# EAGLE design PCB - MODULE (EAGLE 8.2.0)

## Sheet 1 of 4: STN1170
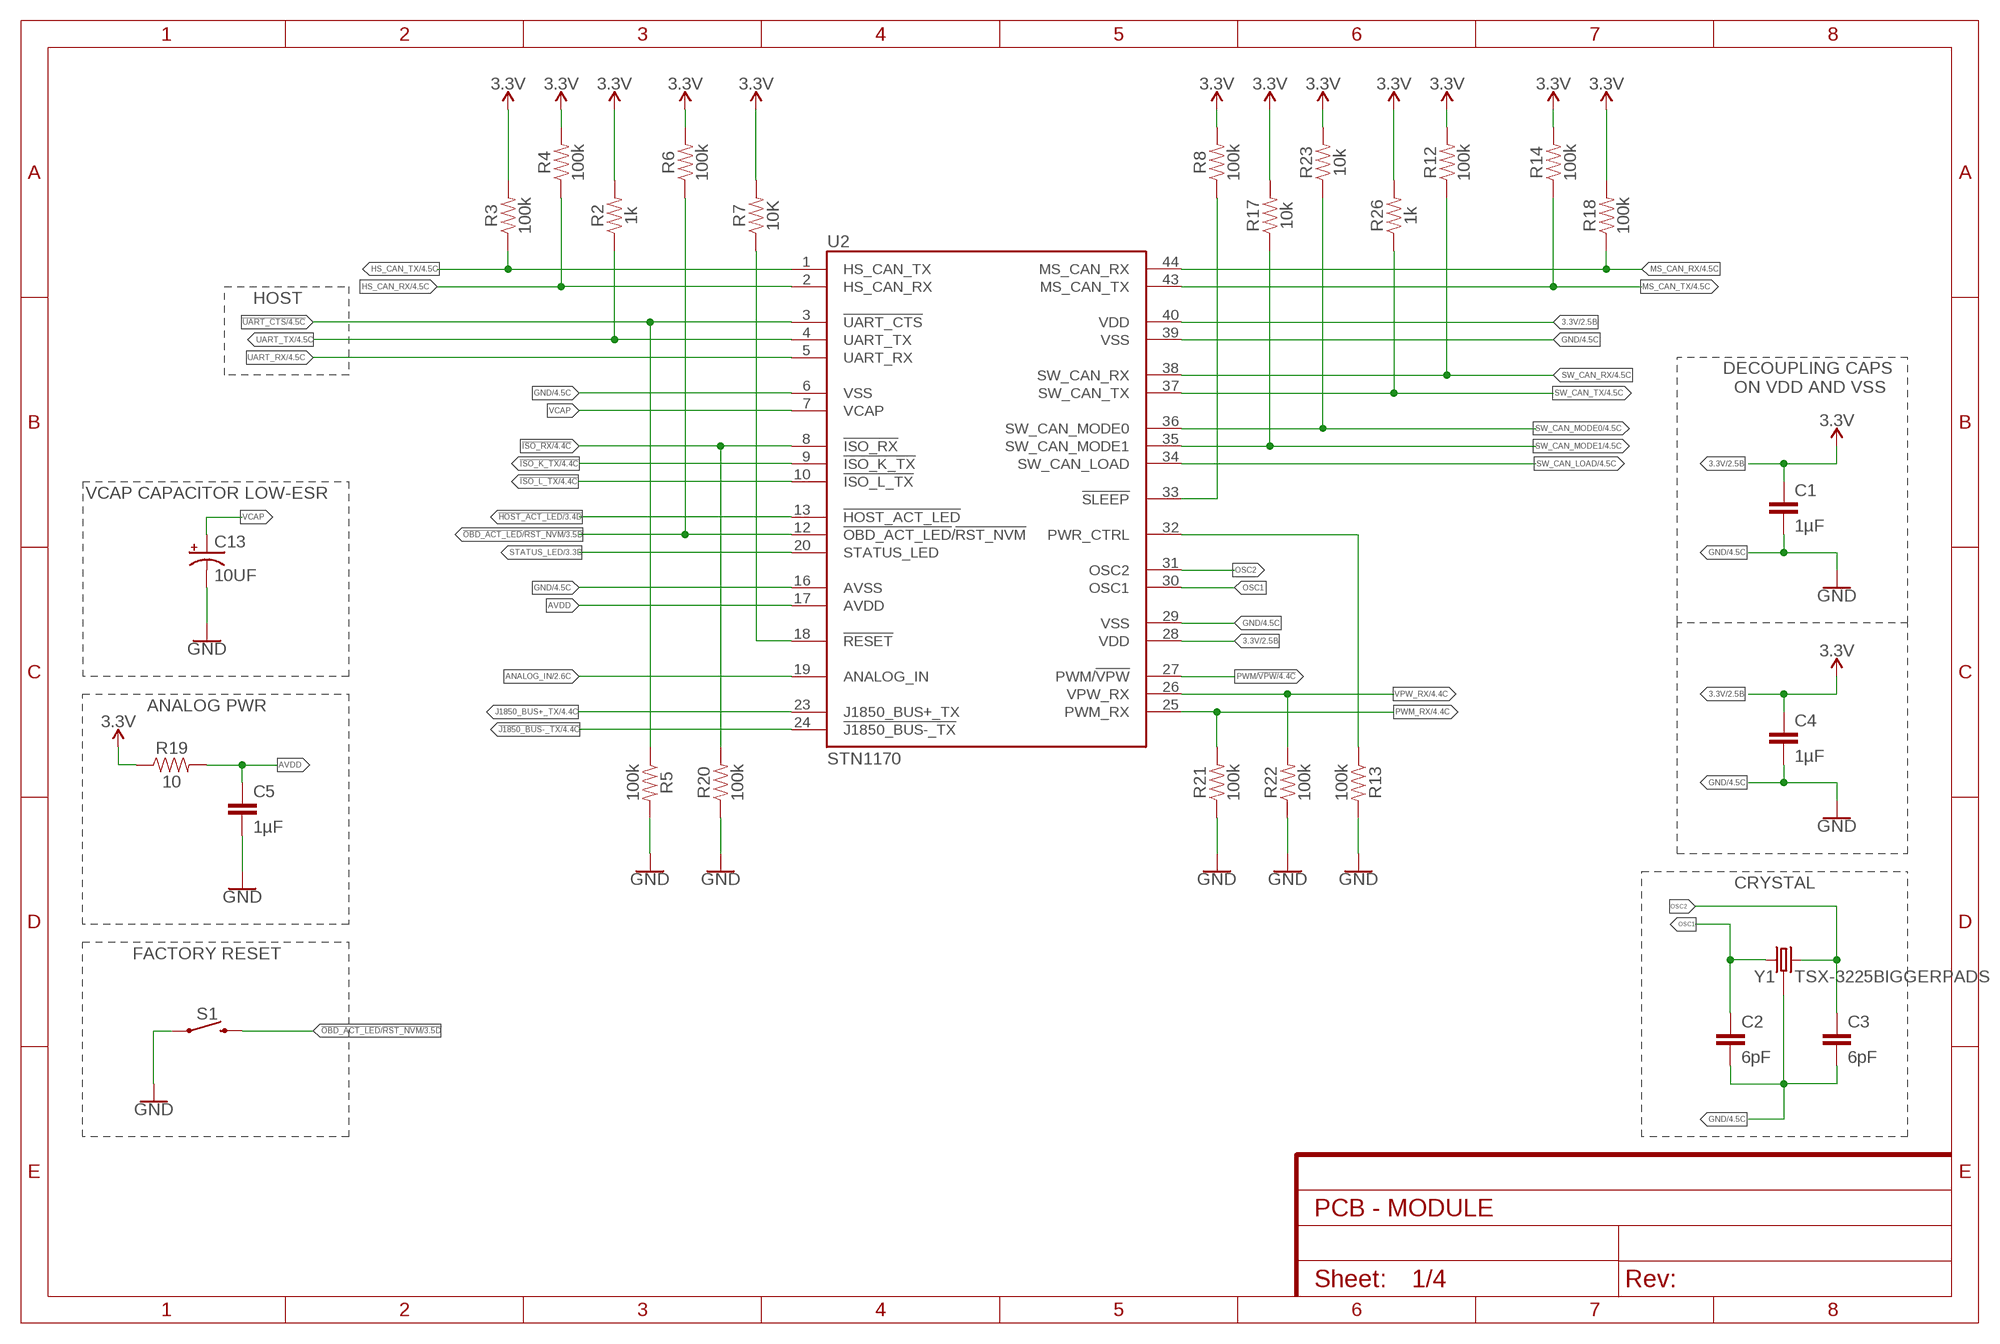
[diagram p0: schematic, sheet 1]

### Parts
C1  1µF  0.33UF/330NF-0805-50V-10%  [0805]
C2  6pF  0.33UF/330NF-0805-50V-10%  [0805]
C3  6pF  0.33UF/330NF-0805-50V-10%  [0805]
C4  1µF  0.33UF/330NF-0805-50V-10%  [0805]
C5  1µF  0.33UF/330NF-0805-50V-10%  [0805]
C13  10UF  [1206]
R2  1k  0.75OHM-0805-1/4W-1%  [0805]
R3  100k  0.75OHM-0805-1/4W-1%  [0805]
R4  100k  0.75OHM-0805-1/4W-1%  [0805]
R5  100k  0.75OHM-0805-1/4W-1%  [0805]
R6  100k  0.75OHM-0805-1/4W-1%  [0805]
R7  10K  0.75OHM-0805-1/4W-1%  [0805]
R8  100k  0.75OHM-0805-1/4W-1%  [0805]
R12  100k  0.75OHM-0805-1/4W-1%  [0805]
R13  100k  0.75OHM-0805-1/4W-1%  [0805]
R14  100k  0.75OHM-0805-1/4W-1%  [0805]
R17  10k  0.75OHM-0805-1/4W-1%  [0805]
R18  100k  0.75OHM-0805-1/4W-1%  [0805]
R19  10  0.75OHM-0805-1/4W-1%  [0805]
R20  100k  0.75OHM-0805-1/4W-1%  [0805]
R21  100k  0.75OHM-0805-1/4W-1%  [0805]
R22  100k  0.75OHM-0805-1/4W-1%  [0805]
R23  10k  0.75OHM-0805-1/4W-1%  [0805]
R26  1k  0.75OHM-0805-1/4W-1%  [0805]
S1  B3U  [B3U-WO-GT-WO-B]
U2  STN1170  [TQFP44]
Y1  TSX-3225BIGGERPADS  [TSX-3225-SOLDERING-IRON]

### Nets
3.3V: C1.1 C4.1 R2.2 R3.2 R4.2 R6.2 R7.2 R8.2 R12.2 R14.2 R17.2 R18.2 R19.1 R23.2 R26.2 U2.28(VDD) U2.40(VDD) ; also sheet 2,3,4
!HOST_ACT_LED: U2.13(!HOST_ACT_LED) ; also sheet 3
!ISO_K_TX: U2.9(!ISO_K_TX) ; also sheet 4
!ISO_L_TX: U2.10(!ISO_L_TX) ; also sheet 4
!ISO_RX: R20.2 U2.8(!ISO_RX) ; also sheet 4
!J1850_BUS-_TX: U2.24(!J1850_BUS-_TX) ; also sheet 4
!OBD_ACT_LED!/!RST_NVM: R6.1 S1.2 U2.12(!OBD_ACT_LED!/!RST_NVM) ; also sheet 3
!RESET: R7.1 U2.18(!RESET)
!SLEEP: R8.1 U2.33(!SLEEP)
!UART_CTS: R5.1 U2.3(!UART_CTS) ; also sheet 4
ANALOG_IN: U2.19(ANALOG_IN) ; also sheet 2
AVDD: C5.1 R19.2 U2.17(AVDD)
GND: C1.2 C2.2 C3.2 C4.2 C5.2 C13.2(-) R5.2 R13.2 R20.1 R21.1 R22.1 S1.1 U2.6(VSS) U2.16(AVSS) U2.29(VSS) U2.39(VSS) Y1.2 Y1.4 ; also sheet 2,3,4
HS_CAN_RX: R4.1 U2.2(HS_CAN_RX) ; also sheet 4
HS_CAN_TX: R3.1 U2.1(HS_CAN_TX) ; also sheet 4
J1850_BUS+_TX: U2.23(J1850_BUS+_TX) ; also sheet 4
MS_CAN_RX: R18.1 U2.44(MS_CAN_RX) ; also sheet 4
MS_CAN_TX: R14.1 U2.43(MS_CAN_TX) ; also sheet 4
OSC1: C2.1 U2.30(OSC1) Y1.1
OSC2: C3.1 U2.31(OSC2) Y1.3
PWM/!VPW: U2.27(PWM/!VPW!) ; also sheet 4
PWM_RX: R21.2 U2.25(PWM_RX) ; also sheet 4
PWR_CTRL: R13.1 U2.32(PWR_CTRL)
STATUS_LED: U2.20(STATUS_LED) ; also sheet 3
SW_CAN_LOAD: U2.34(SW_CAN_LOAD) ; also sheet 4
SW_CAN_MODE0: R23.1 U2.36(SW_CAN_MODE0) ; also sheet 4
SW_CAN_MODE1: R17.1 U2.35(SW_CAN_MODE1) ; also sheet 4
SW_CAN_RX: R12.1 U2.38(SW_CAN_RX) ; also sheet 4
SW_CAN_TX: R26.1 U2.37(SW_CAN_TX) ; also sheet 4
UART_RX: U2.5(UART_RX) ; also sheet 4
UART_TX: R2.1 U2.4(UART_TX) ; also sheet 4
VCAP: C13.1(+) U2.7(VCAP)
VPW_RX: R22.2 U2.26(VPW_RX) ; also sheet 4

### Notes on the sheet
- HOST
- DECOUPLING CAPS 
  ON VDD AND VSS
- VCAP CAPACITOR LOW-ESR
- ANALOG PWR
- CRYSTAL
- FACTORY RESET

## Sheet 2 of 4: Current Sense
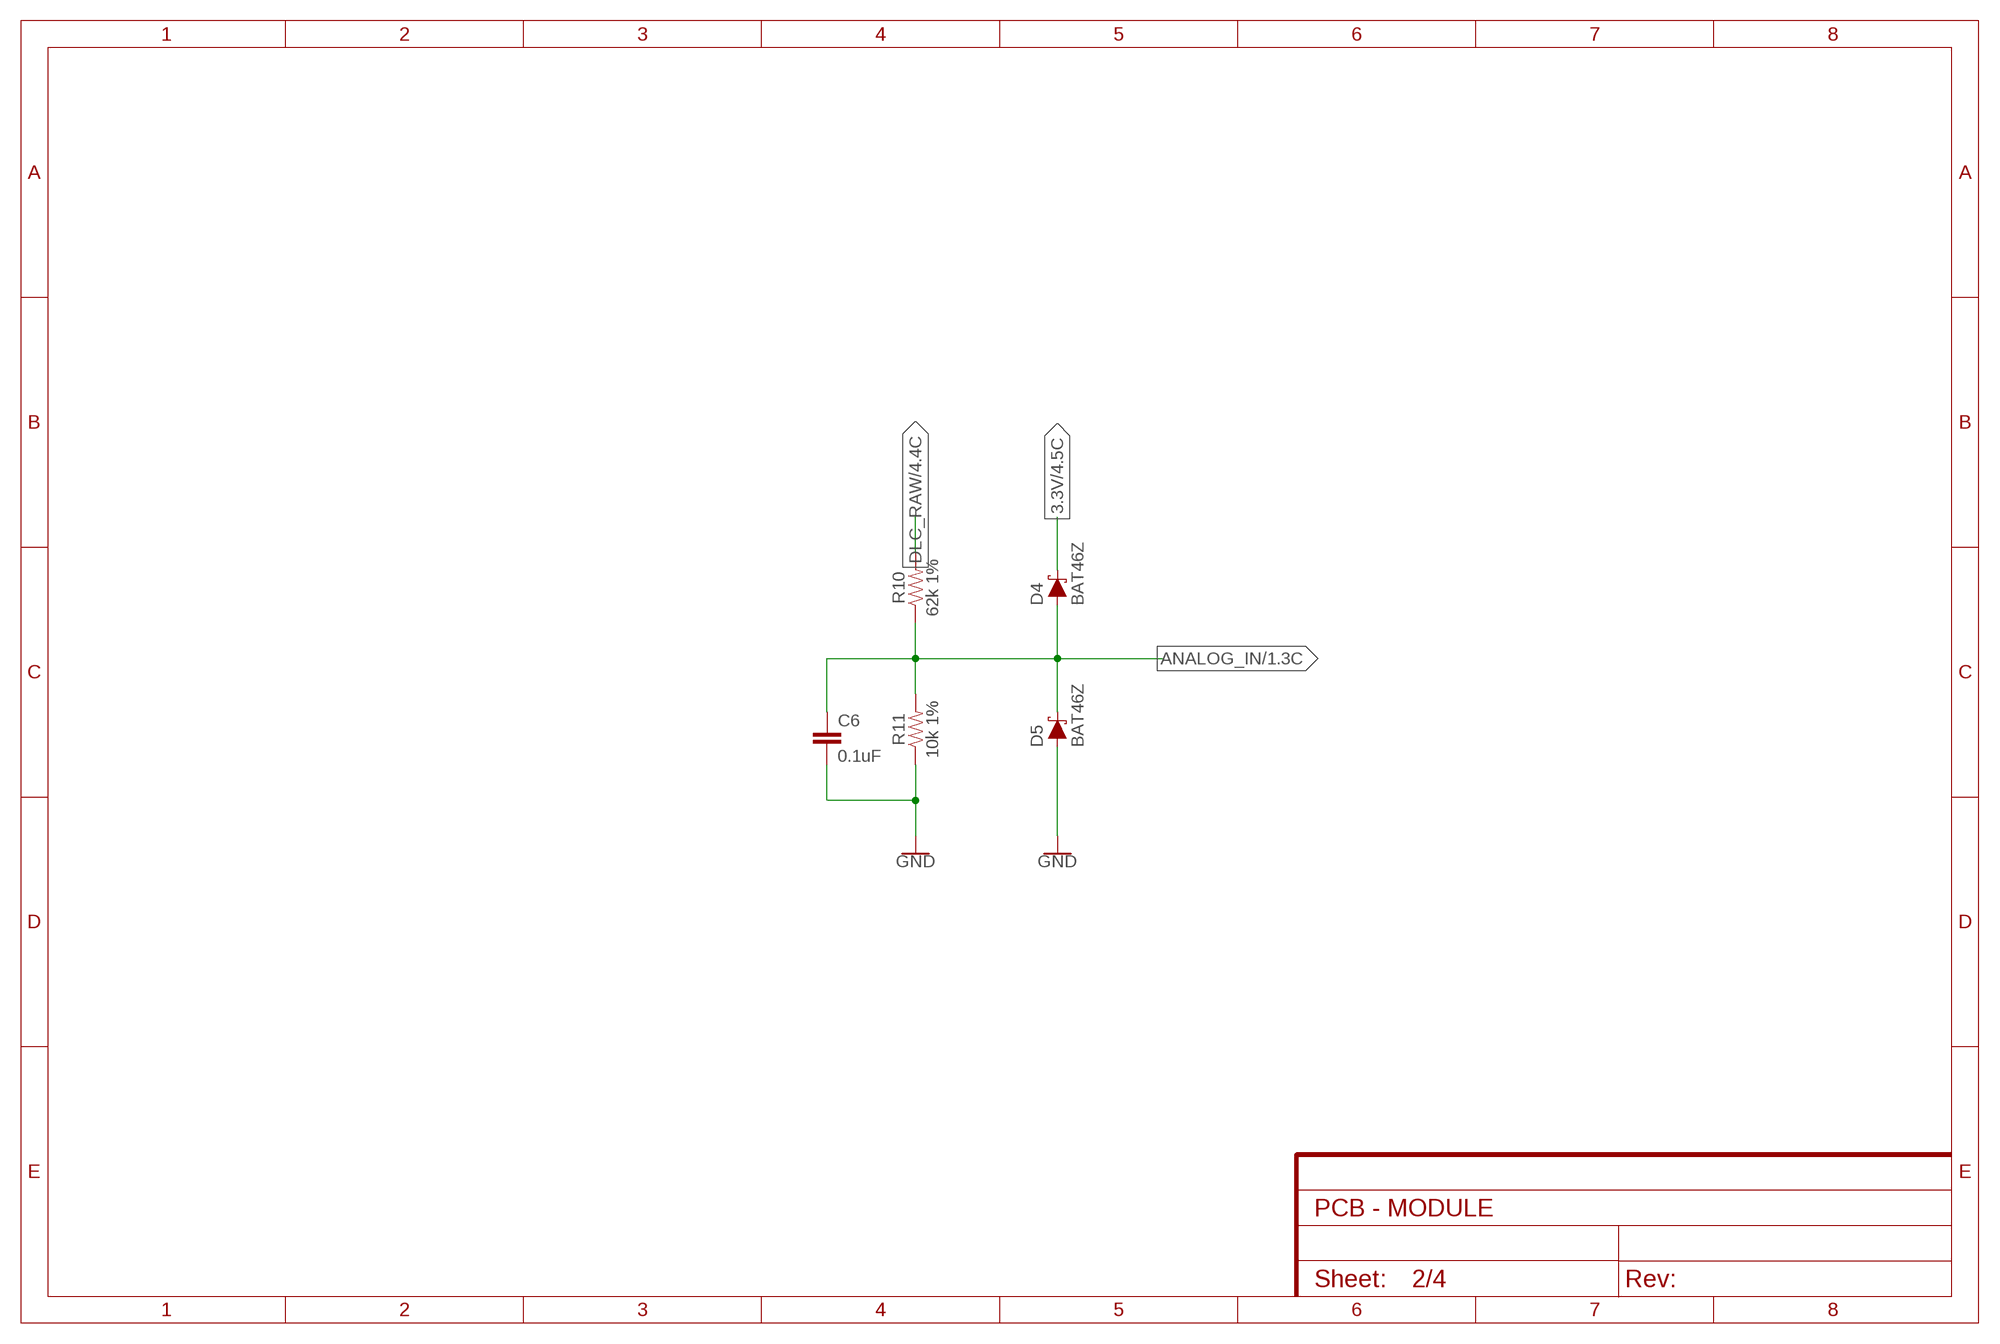
[diagram p1: schematic, sheet 2]

### Parts
C6  0.1uF  0.33UF/330NF-0805-50V-10%  [0805]
D4  BAT46Z  [SOD-123]
D5  BAT46Z  [SOD-123]
R10  62k 1%  0.75OHM-0805-1/4W-1%  [0805]
R11  10k 1%  0.75OHM-0805-1/4W-1%  [0805]

### Nets
3.3V: D4.C ; also sheet 1,3,4
ANALOG_IN: C6.1 D4.A D5.C R10.1 R11.2 ; also sheet 1
DLC_RAW: R10.2 ; also sheet 4
GND: C6.2 D5.A R11.1 ; also sheet 1,3,4

## Sheet 3 of 4: LED's
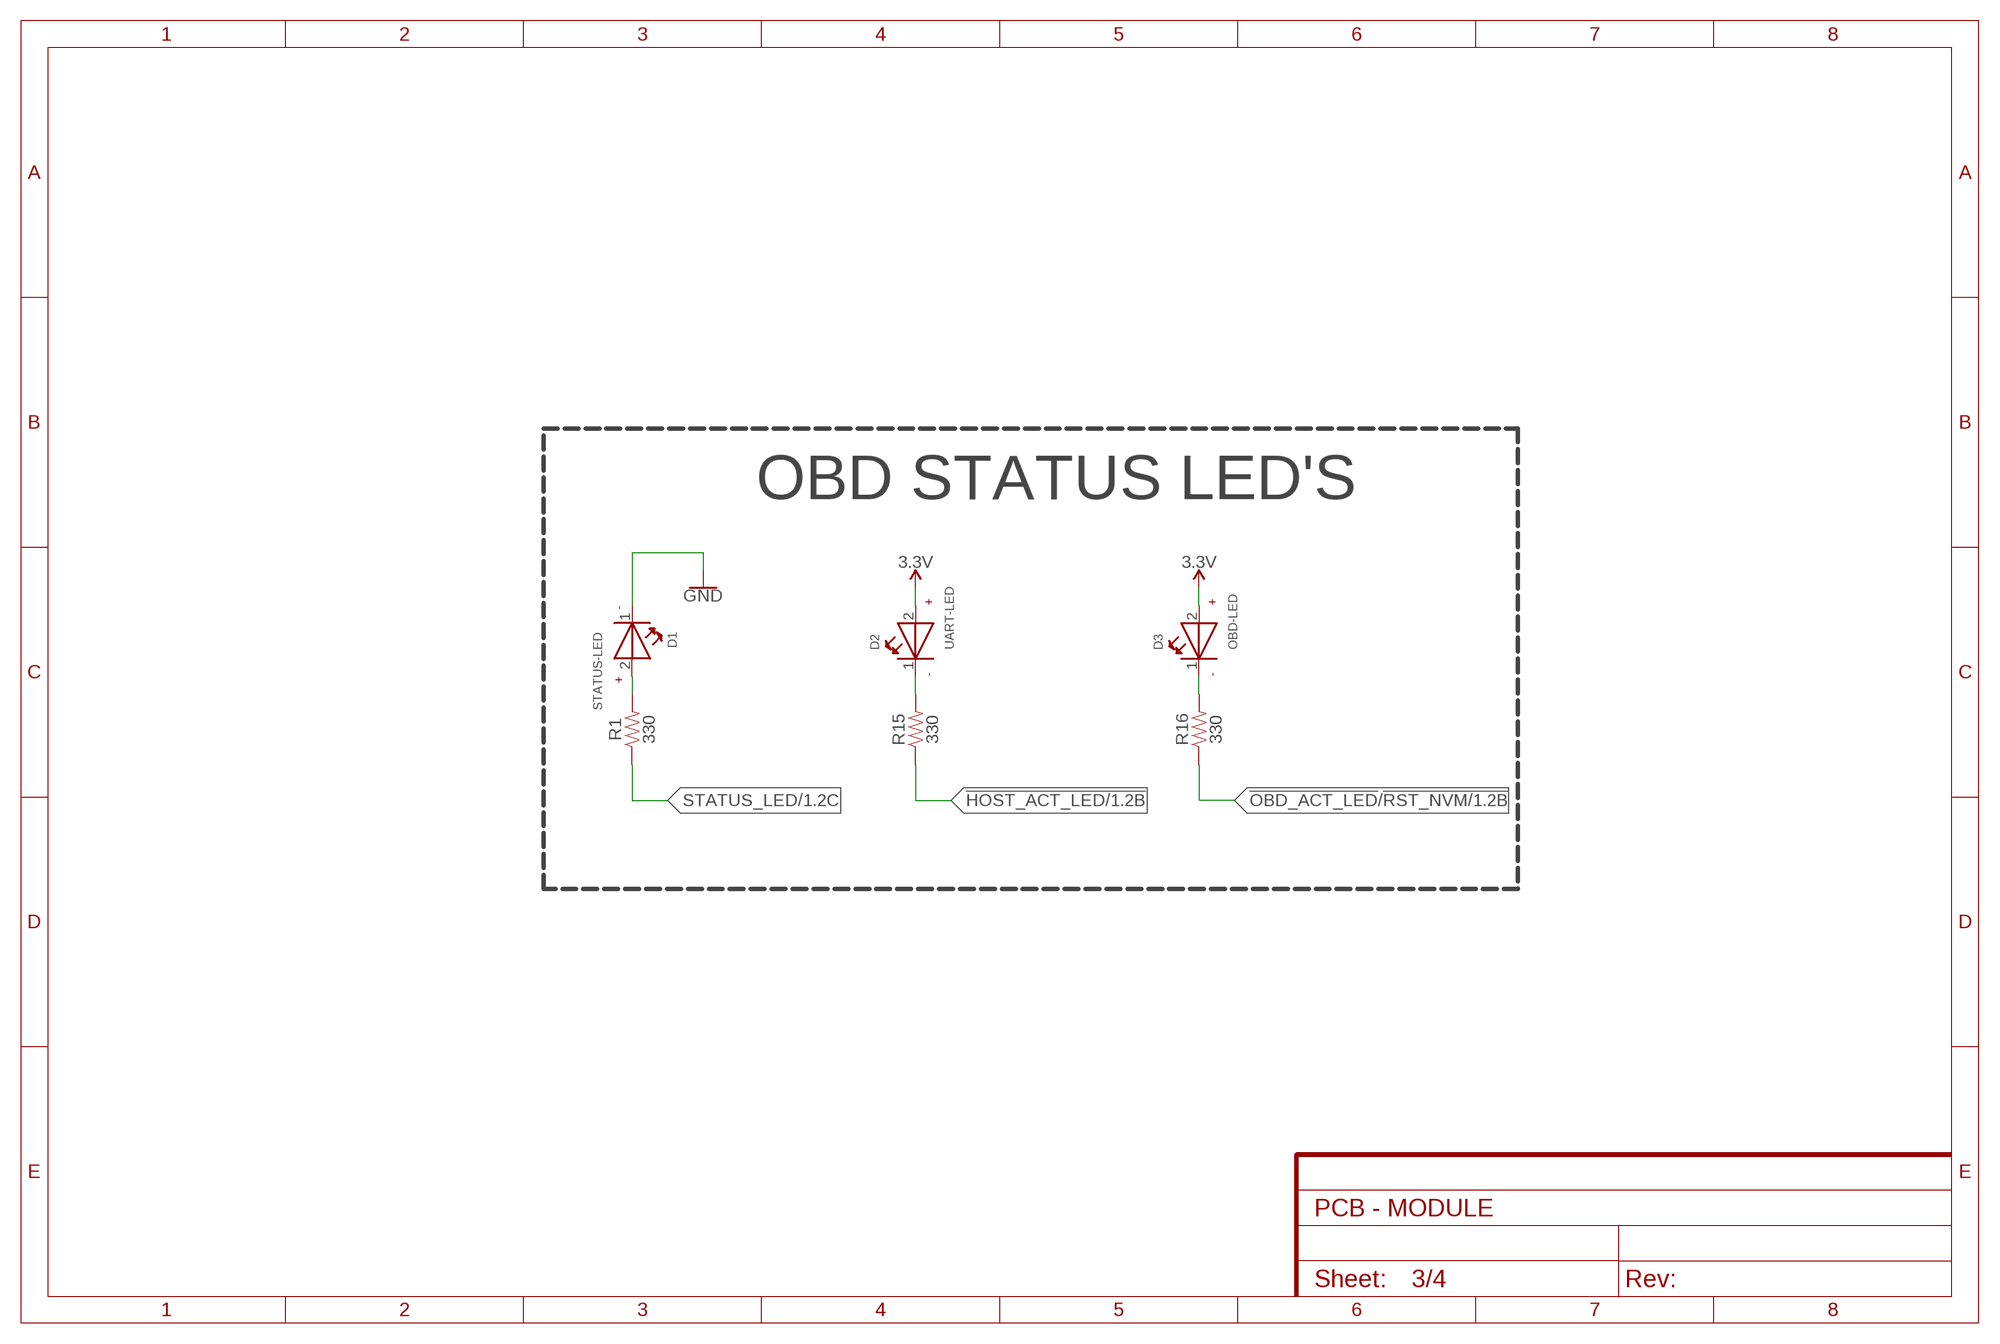
[diagram p2: schematic, sheet 3]

### Parts
D1  STATUS-LED  WL-SMCW-150120RS75000-R  [WL-SMCW_1206]
D2  UART-LED  WL-SMCW-150120YS75000-Y  [WL-SMCW_1206]
D3  OBD-LED  WL-SMCW-150120GS75000-G  [WL-SMCW_1206]
R1  330  0.75OHM-0805-1/4W-1%  [0805]
R15  330  0.75OHM-0805-1/4W-1%  [0805]
R16  330  0.75OHM-0805-1/4W-1%  [0805]

### Nets
3.3V: D2.2(+) D3.2(+) ; also sheet 1,2,4
!HOST_ACT_LED: R15.1 ; also sheet 1
!OBD_ACT_LED!/!RST_NVM: R16.1 ; also sheet 1
GND: D1.1(-) ; also sheet 1,2,4
N$3: D1.2(+) R1.2
N$4: D3.1(-) R16.2
N$5: D2.1(-) R15.2
STATUS_LED: R1.1 ; also sheet 1

### Notes on the sheet
- OBD STATUS LED'S

## Sheet 4 of 4: Pinout for board
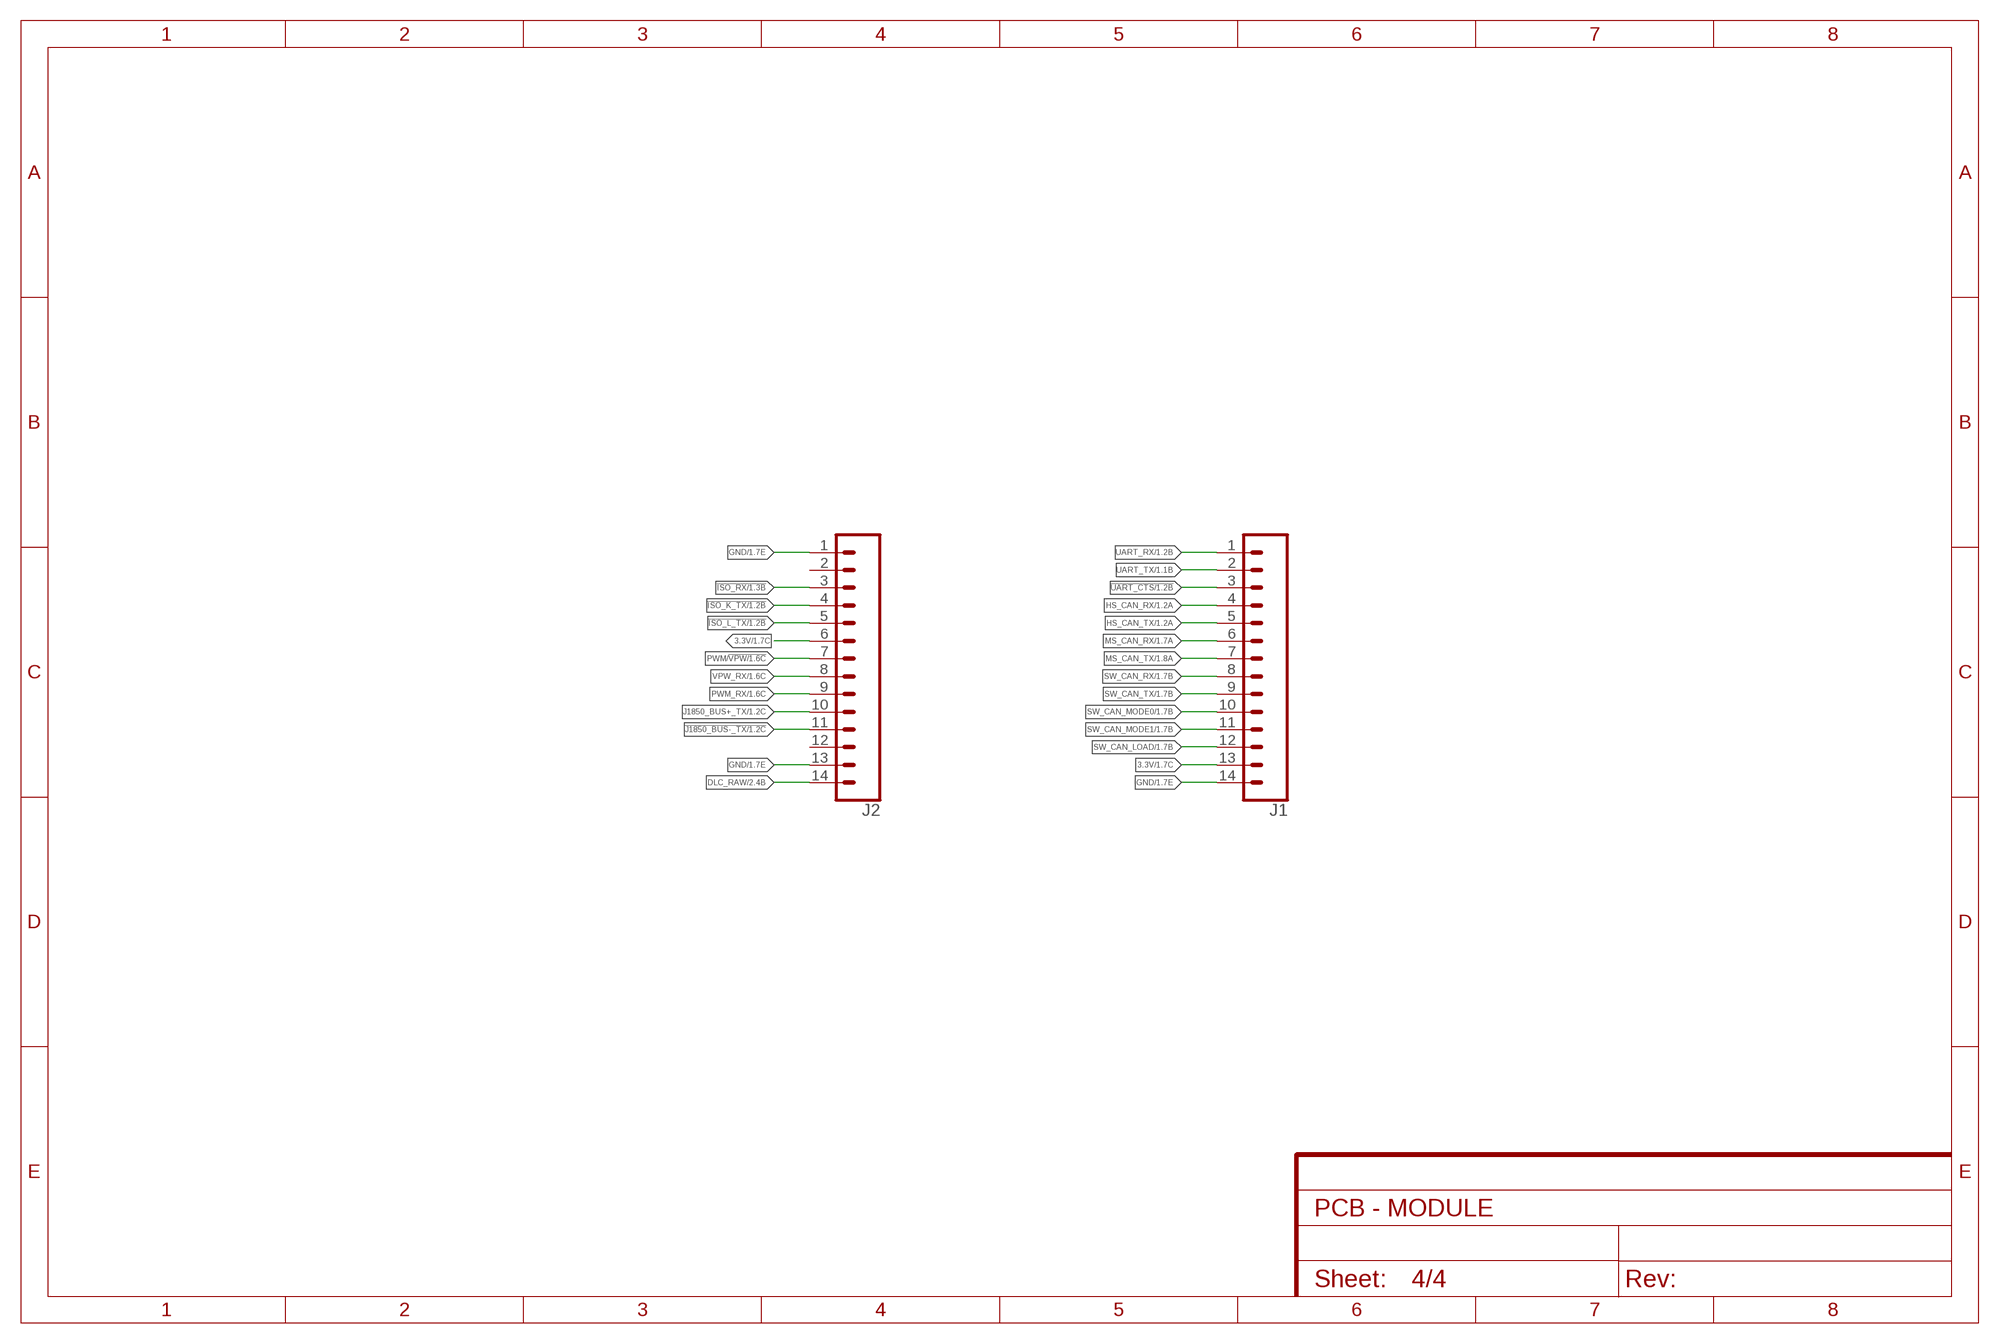
[diagram p3: schematic, sheet 4]

### Parts
J1  CONN_14  [1X14]
J2  CONN_14  [1X14]

### Nets
3.3V: J1.13 J2.6 ; also sheet 1,2,3
!ISO_K_TX: J2.4 ; also sheet 1
!ISO_L_TX: J2.5 ; also sheet 1
!ISO_RX: J2.3 ; also sheet 1
!J1850_BUS-_TX: J2.11 ; also sheet 1
!UART_CTS: J1.3 ; also sheet 1
DLC_RAW: J2.14 ; also sheet 2
GND: J1.14 J2.1 J2.13 ; also sheet 1,2,3
HS_CAN_RX: J1.4 ; also sheet 1
HS_CAN_TX: J1.5 ; also sheet 1
J1850_BUS+_TX: J2.10 ; also sheet 1
MS_CAN_RX: J1.6 ; also sheet 1
MS_CAN_TX: J1.7 ; also sheet 1
PWM/!VPW: J2.7 ; also sheet 1
PWM_RX: J2.9 ; also sheet 1
SW_CAN_LOAD: J1.12 ; also sheet 1
SW_CAN_MODE0: J1.10 ; also sheet 1
SW_CAN_MODE1: J1.11 ; also sheet 1
SW_CAN_RX: J1.8 ; also sheet 1
SW_CAN_TX: J1.9 ; also sheet 1
UART_RX: J1.1 ; also sheet 1
UART_TX: J1.2 ; also sheet 1
VPW_RX: J2.8 ; also sheet 1
Unconnected: J2.2 J2.12

## Library data of the parts
C1-C6 = SparkFun-Capacitors:0.33UF/330NF: 0.33µF/330nF ceramic capacitors A capacitor is a passive two-terminal electrical component used to store electrical energy temporarily in an electric field.; PROD_ID: CAP-08469; VALUE: 0.33µF
C13 = prywatne:10UF: Tantalum, LOW-ESR capacitor AVX F931C106KAA
D1-D3 = EAGLE-COLOR_LED-rev17b:WL-SMCW: SMD mono-color Chip LED Characteristics Low energy consumption High reliability Low current requirement Fast switching No UV/IR radiation Smallest SMD package with exceptional brightness Top view Wide viewing angle PBC high-usage Applications Backlight for mobile and portable device keypads Indoor and outdoor message boards Flat backlight for LCDs, switches and symbols Display for industrial control systems and traffic Miniaturized color effects Pedestrian mark Optical indicators General lighting Toys <http://katalog.we-online.de/media/images/eipal/WL-SMCW_pf2.jpg> Details see: http://katalog.we-online.de/en/led/WL-SMCW?m Updated 2015-04-10 2015 (C) Wurth Elektronik
D4 D5 = Goodies:BAT46Z
J1 J2 = SparkFun-Connectors:CONN_14: Multi connection point. Often used as Generic Header-pin footprint for 0.1 inch spaced/style header connections On any of the 0.1 inch spaced packages, you can populate with these: Break Away Headers - Straight <https://www.sparkfun.com/products/116> (PRT-00116) Break Away Male Headers - Right Angle <https://www.sparkfun.com/products/553> (PRT-00553) Female Headers <https://www.sparkfun.com/products/115> (PRT-00115) Break Away Headers - Machine Pin <https://www.sparkfun.com/products/117> (PRT-00117) Break Away Female Headers - Swiss Machine Pin <https://www.sparkfun.com/products/743> (PRT-00743) For SCREWTERMINALS and SPRING TERMINALS visit here: Screw Terimnals on SparkFun.com <https://www.sparkfun.com/search/results?term=Screw+Terminals> (5mm/3.5mm/2.54mm spacing) This device is also useful as a general connection point to wire up your design to another part of your project. Our various solder wires solder well into these plated through hole pads. Hook-Up Wire - Assortment (Stranded, 22 AWG) <https://www.sparkfun.com/products/11375> (PRT-11375) Hook-Up Wire - Assortment (Solid Core, 22 AWG) <https://www.sparkfun.com/products/11367> (PRT-11367) View the entire wire category on our website here <https://www.sparkfun.com/categories/141> Special notes: Molex polarized connector foot print use with SKU : PRT-08231 with associated crimp pins and housings. 1MM SMD Version SKU: PRT-10208 NOTES ON THE VARIANTS LOCK and LOCK_LONGPADS... This footprint was designed to help hold the alignment of a through-hole component (i.e. 6-pin header) while soldering it into place. You may notice that each hole has been shifted either up or down by 0.005 of an inch from it's more standard position (which is a perfectly straight line). This slight alteration caused the pins (the squares in the middle) to touch the edges of the holes. Because they are alternating, it causes a "brace" to hold the component in place. 0.005 has proven to be the perfect amount of "off-center" position when using our standard breakaway headers. Although looks a little odd when you look at the bare footprint, once you have a header in there, the alteration is very hard to notice. Also,if you push a header all the way into place, it is covered up entirely on the bottom side.
R1-R8 R10-R23 R26 = SparkFun-Resistors:0.75OHM: 0.75Ω resistor A resistor is a passive two-terminal electrical component that implements electrical resistance as a circuit element. Resistors act to reduce current flow, and, at the same time, act to lower voltage levels within circuits. - Wikipedia; PROD_ID: RES-08474; VALUE: 0.75
S1 = Goodies:B3U: Ultra-small-sized Tactile Switch with High Contact Reliability: 1.2 × 3 × 2.5 mm (H × W ×D)
U2 = prywatne:STN1170: STN1170 44-Lead Plastic Thin Quad Flatpack – 10x10x1 mm Body, 2.00 mm Footprint Multiprotocol OBD to UART interpreter UNTESTED
Y1 = Goodies:TSX-3225: EPSON TIMING CRYSTAL, TSX-3225 FAMILY CRYSTAL DIMENSION 3,2 X 2,5 MM

## Board
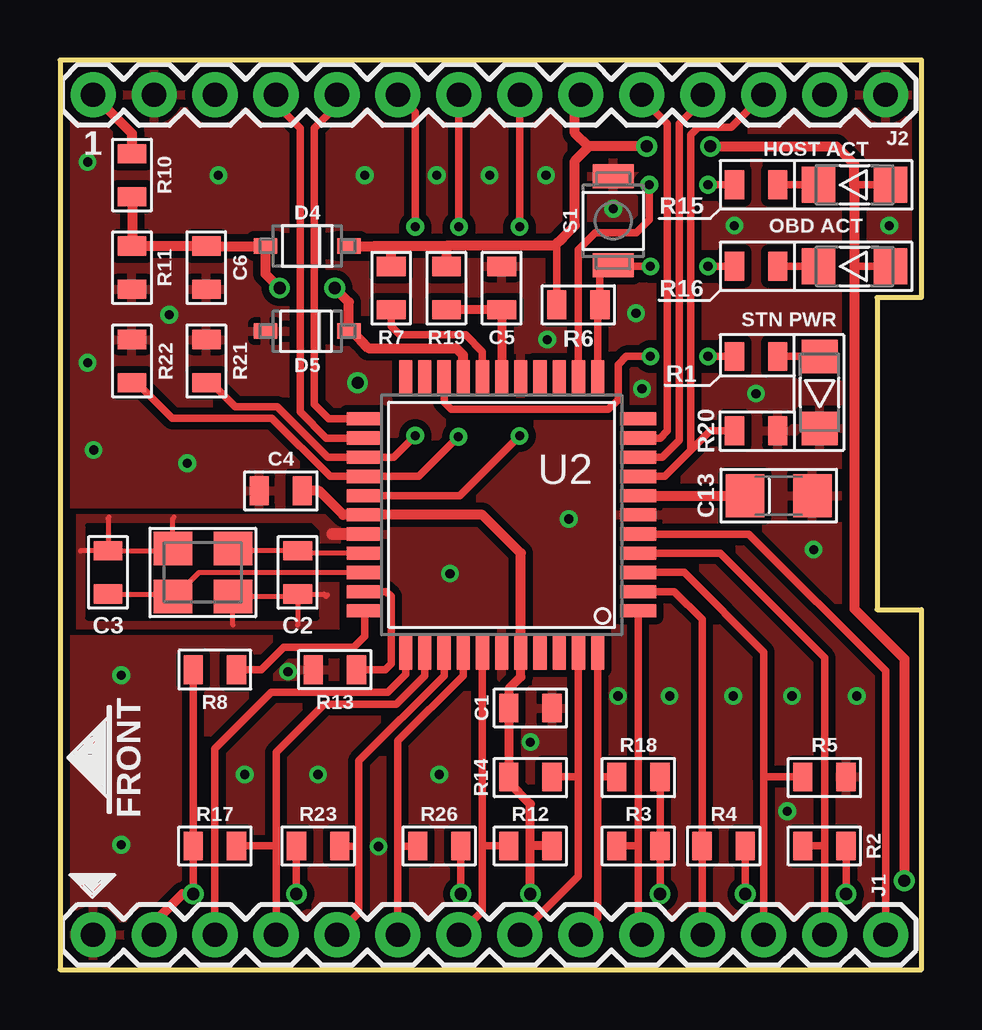
[diagram p4: board, top side]
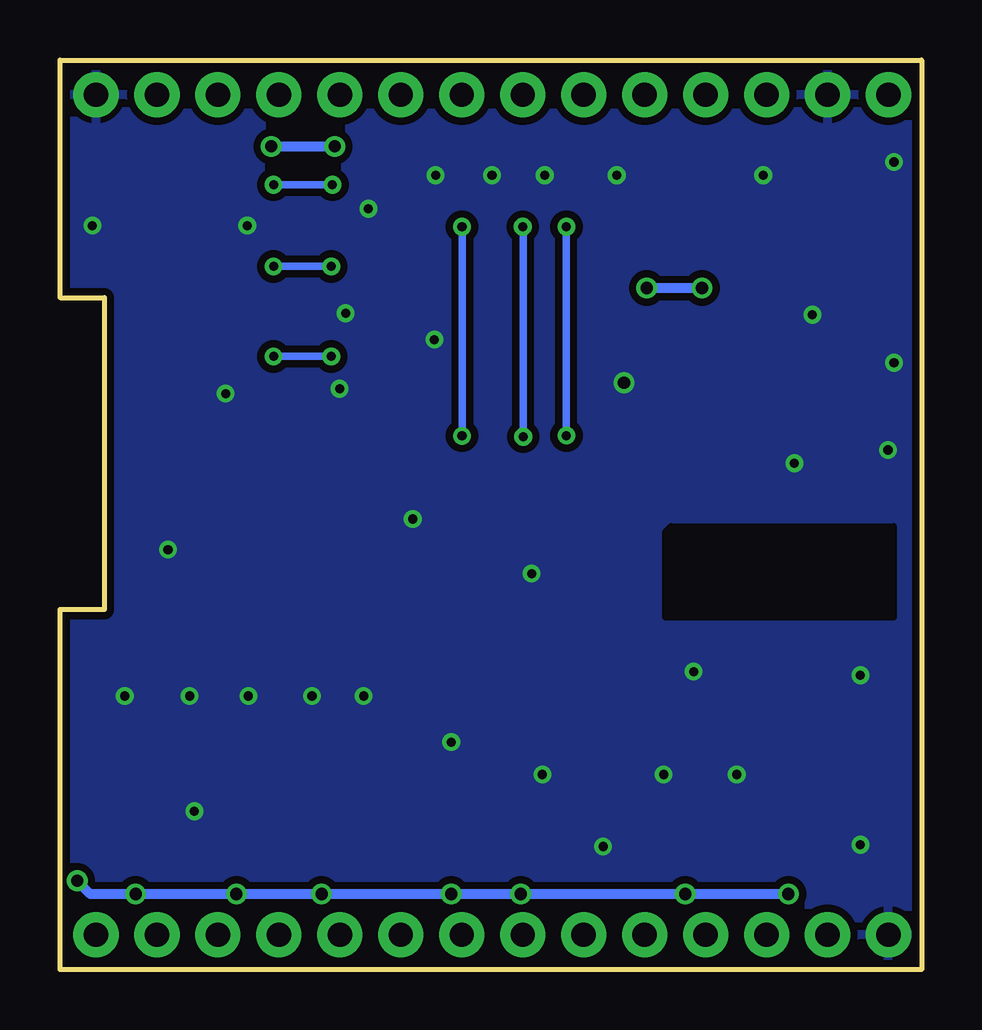
[diagram p5: board, bottom side, seen from below]

Size 35.9 x 37.9 mm. Coordinates in mm from the lower left corner, seen from the top.
Outline: 35.9,37.9 0,37.9 0,0 35.9,0 35.9,15 34.05,15 34.05,28 35.9,28 35.9,37.9
Copper layers (1*16): Top 0.035mm / dielectric 1.5mm / Bottom 0.035mm
Design rules "SparkFun-2-layer-TIGHT": minimum track width 7mil, minimum drill 15mil, track to track 7mil, track to pad 7mil, pad to pad 7mil, via to via 7mil, smd to smd 7mil, copper to edge 7mil, drill to drill 7mil, minimum pad ring 7mil, minimum via ring 7mil, stop-mask expansion 4mil, vias tented up to drill 25mil, thermal gap 10mil

### Footprints (pad centres in the part's own frame; a part is rotated, then mirrored left to right if it is on the bottom)
0805 = smd 0.8 x 1.2: 1 -0.9,0; 2 0.9,0
1206 = smd 1.6 x 1.8: 1 -1.4,0; 2 1.4,0
WL-SMCW_1206 = smd 1.4 x 1.5: 1 -1.5,0; 2 1.5,0
SOD-123 = smd 0.97 x 0.65: A -1.74,0; C 1.74,0
1X14 = drill 1.016 pad 1.88: 1 0,0; 2 2.54,0; 3 5.08,0; 4 7.62,0; 5 10.16,0; 6 12.7,0; 7 15.24,0; 8 17.78,0; 9 20.32,0; 10 22.86,0; 11 25.4,0; 12 27.94,0; 13 30.48,0; 14 33.02,0
B3U-WO-GT-WO-B = smd 1 x 1.7: 1 -1.85,0; 2 1.85,0
TQFP44 = smd 1.5 x 0.55: 1 -5.7,4; 2 -5.7,3.2; 3 -5.7,2.4; 4 -5.7,1.6; 5 -5.7,0.8; 6 -5.7,0; 7 -5.7,-0.8; 8 -5.7,-1.6; 9 -5.7,-2.4; 10 -5.7,-3.2; 11 -5.7,-4; 23 5.7,-4; 24 5.7,-3.2; 25 5.7,-2.4; 26 5.7,-1.6; 27 5.7,-0.8; 28 5.7,0; 29 5.7,0.8; 30 5.7,1.6; 31 5.7,2.4; 32 5.7,3.2; 33 5.7,4 | smd 0.55 x 1.5: 12 -4,-5.7; 13 -3.2,-5.7; 14 -2.4,-5.7; 15 -1.6,-5.7; 16 -0.8,-5.7; 17 0,-5.7; 18 0.8,-5.7; 19 1.6,-5.7; 20 2.4,-5.7; 21 3.2,-5.7; 22 4,-5.7; 34 4,5.7; 35 3.2,5.7; 36 2.4,5.7; 37 1.6,5.7; 38 0.8,5.7; 39 0,5.7; 40 -0.8,5.7; 41 -1.6,5.7; 42 -2.4,5.7; 43 -3.2,5.7; 44 -4,5.7
TSX-3225-SOLDERING-IRON = smd 1.6 x 1.4: 1 -1.25,-1; 2 1.25,-1; 3 1.25,1; 4 -1.25,1

### Placement (x,y rotation side)
C1  19.6,10.9 0 top
C2  9.9,16.55 270 top
C3  2,16.55 90 top
C4  9.2,19.95 180 top
C5  18.4,28.4 90 top
C6  6.1,29.25 270 top
C13  29.95,19.75 0 top
D1  31.65,24.05 90 top
D2  33.1,32.7 0 top
D3  33.1,29.3 0 top
D4  10.3,30.15 0 top
D5  10.3,26.6 0 top
J1  34.4,1.45 180 top
J2  34.4,36.45 180 top
R1  29,25.55 0 top
R2  31.85,5.15 0 top
R3  24.1,5.15 0 top
R4  27.65,5.15 0 top
R5  31.85,8.03 0 top
R6  21.6,27.7 180 top
R7  13.8,28.4 90 top
R8  6.45,12.5 180 top
R10  3,33.1 90 top
R11  3,29.25 90 top
R12  19.6,5.15 0 top
R13  11.45,12.5 180 top
R14  19.6,8.03 180 top
R15  29,32.7 0 top
R16  29,29.3 0 top
R17  6.45,5.15 180 top
R18  24.1,8.03 0 top
R19  16.1,28.4 270 top
R20  29,22.45 180 top
R21  6.1,25.35 270 top
R22  3,25.35 270 top
R23  10.75,5.15 180 top
R26  15.8,5.15 0 top
S1  23.05,31.2 270 top
U2  18.4,18.95 180 top
Y1  5.95,16.55 180 top

### Tracks (layer width: path | path; a pad name or v marks a point on that pad's centre or on a via)
3.3V  (via drill 0.51)
  Top 0.305: v25,3.15 R3.2 R18.2 | R4.2 v28.55,3.15 | R2.2 v32.75,3.15 | R23.2 v9.85,3.15 | R8.2 R17.2 v5.55,3.15 | R26.2 v16.7,3.15 | 20.97,30.52 20.7,30.25 R6.2 | D2.2 33.15,32.7 33.1,32.65 | D3.2 33.2,29.3 33.1,29.4
  Top 0.381: v19.6,3.15 19.6,5.15 | R12.2 19.6,5.15 | U2.40 19.2,12.2 18.7,11.7 C1.1 R14.2 18.7,7.8 19.6,6.9 19.6,5.15
  Top 0.406: 13.85,30.15 16.1,30.15 | 13.85,30.15 13.1,30.15 D4.C | R7.2 13.8,30.1 13.85,30.15 | 16.1,30.15 R19.1 | v5.55,3.15 5.1,3.15 3.92,1.97 J1.13 | C4.1 10.8,19.95 11.8,18.95 U2.28 17.6,18.95 19.2,17.35 U2.40 | C4.1 | 16.1,30.15 20.6,30.15 20.97,30.52 21.45,31 21.45,33.7 22.05,34.3 | v24.45,34.3 22.05,34.3 | 22.05,34.3 22,34.3 21.45,34.85 21.45,36.2 J2.6 | v35.18,3.7 35.18,12.95 33.1,15.03 33.1,29.4 33.1,32.65 33.1,33.55 32.35,34.3 v27.1,34.3
  Bottom 0.406: v27.1,34.3 v24.45,34.3 | v5.55,3.15 v9.85,3.15 v16.7,3.15 v19.6,3.15 v25,3.15 v28.55,3.15 v32.75,3.15 34.63,3.15 v35.18,3.7
!HOST_ACT_LED  (via drill 0.38)
  Top 0.305: R15.1 v27,32.7 | U2.13 21.6,30 22.3,30.7 24,30.7 24.55,31.25 v24.55,32.7
  Bottom 0.305: v27,32.7 v24.55,32.7
!ISO_K_TX
  Top 0.305: J2.4 26.78,36.23 25.8,35.25 25.8,22.05 25.1,21.35 U2.9
!ISO_L_TX
  Top 0.305: J2.5 24.24,36.31 25.3,35.25 25.3,22.45 25,22.15 U2.10
!ISO_RX
  Top 0.305: 26.28,21.63 25.2,20.55 U2.8 | R20.2 27.1,22.45 26.28,21.63 | J2.3 27.97,35.1 26.6,35.1 26.28,34.78 26.28,21.63
!J1850_BUS-_TX
  Top 0.305: J2.11 9,36.05 10,35.05 10,23.25 11.1,22.15 U2.24
!OBD_ACT_LED!/!RST_NVM  (via drill 0.38)
  Top 0.305: U2.12 22.4,27.6 R6.1 22.5,29.3 23.1,29.3 | R16.1 v27,29.3 | 23.1,29.3 v24.6,29.3 | 23.1,29.3 S1.2
  Bottom 0.305: v27,29.3 v24.6,29.3
!RESET
  Top 0.305: U2.18 17.6,25.75 16.9,26.45 14.15,26.45 13.8,26.8 R7.1
!SLEEP
  Top 0.305: R8.1 8.38,12.5 9.31,13.43 12.23,13.43 12.7,13.9 U2.33
!UART_CTS
  Top 0.305: 29.32,8 J1.3 | 29.32,8 29.32,13.23 26,16.55 U2.3 | R5.1 29.34,8.03 29.32,8
ANALOG_IN  (via drill 0.51)
  Top 0.406: R10.1 R11.2 C6.1 D4.A 8.56,28.99 v9.15,28.4 | U2.19 16.8,25.6 16.5,25.9 12.85,25.9 12.5,26.25 | 12.5,26.25 12.15,26.6 | 12.15,26.6 D5.C 12.04,27.81 v11.45,28.4 | 12.15,26.6 12.5,26.25
  Bottom 0.406: v9.15,28.4 v11.45,28.4
AVDD
  Top 0.381: U2.17 C5.1 R19.2
DLC_RAW
  Top 0.406: R10.2 3,34.83 J2.14
GND  (via drill 0.38, 0.51)
  Top 0.203: 11.15,15.6 11.1,15.55 11,15.65 C2.2 | 2.05,18.85 2,18.8 C3.2 | 4.75,18.85 4.7,18.8 Y1.2 4.5,17.35 4.4,17.45 C3.2 | 7.2,14.35 Y1.4 9.8,15.55 C2.2 | C3.2 0.85,17.45 | C2.2 9.9,14.35
  Top 0.508: U2.29 11.35,18.15
  other vias: 12.4,24.45 28.1,31 29,24 4.55,27.28 17.9,33.1 12.7,33.1 2.55,5.2 2.55,12.27 5.3,21.1 16.25,16.5 21.2,18.77 28.05,11.4 25.4,11.4 19.6,9.48 15.8,8.13 10.75,8.13 7.7,8.13 15.7,33.1 33.2,11.4 20.3,26.25 9.5,12.42 1.15,33.65 30.5,11.4 30.3,6.6 23.25,11.4 13.27,5.13 20.25,33.1 23.05,31.7 24,27.35 24.25,24.2 31.4,17.5 34.55,31 1.15,25.28 1.4,21.65 6.6,33.1
  pour Bottom (isolate 0.305): 38.9,-1 -1.1,-1 -1.1,39 38.9,39
  pour Top (isolate 0.305, rank 2): 39.9,-2 -2.1,-2 -2.1,40 39.9,40
HS_CAN_RX
  Top 0.305: J1.4 26.75,1.48 R4.1 26.75,14.6 25.6,15.75 U2.2
HS_CAN_TX
  Top 0.305: J1.5 24.1,1.59 24.1,5.15 | 24.1,5.15 U2.1 | R3.1 24.1,5.15
J1850_BUS+_TX
  Top 0.305: J2.10 11.54,35.99 10.6,35.05 10.6,23.55 11.2,22.95 U2.23
MS_CAN_RX
  Top 0.305: J1.6 22.4,2.15 22.4,8.03 | 22.4,8.03 U2.44 | R18.1 22.4,8.03
MS_CAN_TX
  Top 0.305: J1.7 21.6,3.89 21.6,8.1 | 21.6,8.1 U2.43 | R14.1 21.52,8.03 21.6,8.1
N$2
  cutout Top: 11.95,17.45 10.7,17.45 10.7,18.25 10.45,18.5 1.15,18.5 1.15,14.65 10.7,14.65 10.7,17.2 11.95,17.2
  cutout Bottom: 10.7,14.65 10.7,18.25 10.45,18.5 1.15,18.5 1.15,14.65
N$3
  Top 0.305: D1.2 R1.2 | R1.2
N$4
  Top 0.305: D3.1 R16.2
N$5
  Top 0.305: D2.1 R15.2
N$6
  cutout Top: 9.55,20.75 9.55,19.15 10.8,19.15 10.8,20.75
N$7
  cutout Top: 10.9,19.1 0.55,19.1 0.55,14.05 11.75,14.05 11.75,16.35 11.75,14.05 0.55,14.05 0.55,19.1
OSC1
  Top 0.203: 7,17.35 Y1.1 7.3,17.45 C2.1 10,17.35 U2.30
OSC2
  Top 0.203: Y1.3 4.4,15.55 | U2.31 5.8,16.55 4.8,15.55 Y1.3 | C3.1 4.6,15.65 Y1.3
PWM/!VPW  (via drill 0.38)
  Top 0.305: U2.27 16.66,19.75 v19.15,22.24 | v19.15,30.95 J2.7
  Bottom 0.305: v19.15,30.95 v19.15,22.24
PWM_RX  (via drill 0.38)
  Top 0.305: v14.8,30.95 14.8,35.73 J2.9 | v14.8,22.25 13.9,21.35 U2.25 11.15,21.35 9.05,23.45 7.3,23.45 6.3,24.45 R21.2
  Bottom 0.305: v14.8,22.25 v14.8,30.95
PWR_CTRL
  Top 0.305: R13.1 13.55,12.5 13.79,12.74 13.79,15.55 13.6,15.75 U2.32
STATUS_LED  (via drill 0.38)
  Top 0.305: U2.20 16,23.65 16.3,23.35 22.85,23.35 23.25,23.75 23.25,25.2 23.6,25.55 v24.6,25.55 | R1.1 v27,25.55 | v27,25.55
  Bottom 0.305: v27,25.55 v24.6,25.55
SW_CAN_LOAD
  Top 0.305: U2.34 14.4,12.3 13.65,11.55 8.8,11.55 6.45,9.2 J1.12
SW_CAN_MODE0
  Top 0.305: J1.10 12.45,2.36 12.45,5.15 | U2.36 16,12.25 12.45,8.7 12.45,5.15 | R23.1 12.45,5.15
SW_CAN_MODE1
  Top 0.305: U2.35 15.2,12.25 14,11.05 11,11.05 9,9.05 9,5.25 | J1.11 9,5.25 | R17.1 8.9,5.15 9,5.25
SW_CAN_RX
  Top 0.305: 17.6,5.2 17.6,2.43 J1.8 | 17.6,5.2 U2.38 | R12.1 17.65,5.15 17.6,5.2
SW_CAN_TX
  Top 0.305: U2.37 16.8,12.25 14.08,9.53 14.08,5.15 | 14.08,5.15 J1.9 | R26.1 14.08,5.15
UART_RX
  Top 0.305: J1.1 34.4,12.45 28.7,18.15 U2.5
UART_TX
  Top 0.305: 24.5,17.45 24.4,17.35 U2.4 27.5,17.35 31.86,12.99 31.86,5.15 | 31.86,5.15 J1.2 | R2.1 31.86,5.15
VCAP
  Top 0.406: U2.7 C13.1
VPW_RX  (via drill 0.38)
  Top 0.305: J2.8 v16.62,30.95 | v16.6,22.2 14.95,20.55 U2.26 11.25,20.55 8.83,22.97 4.68,22.97 3.2,24.45 R22.2
  Bottom 0.305: v16.6,22.2 16.6,30.93 v16.62,30.95

### Text on the board
tPlace: 1 | HOST ACT | OBD ACT | STN PWR | FRONT